# EAGLE design Teensy_Stromzaehler (EAGLE 9.6.0)
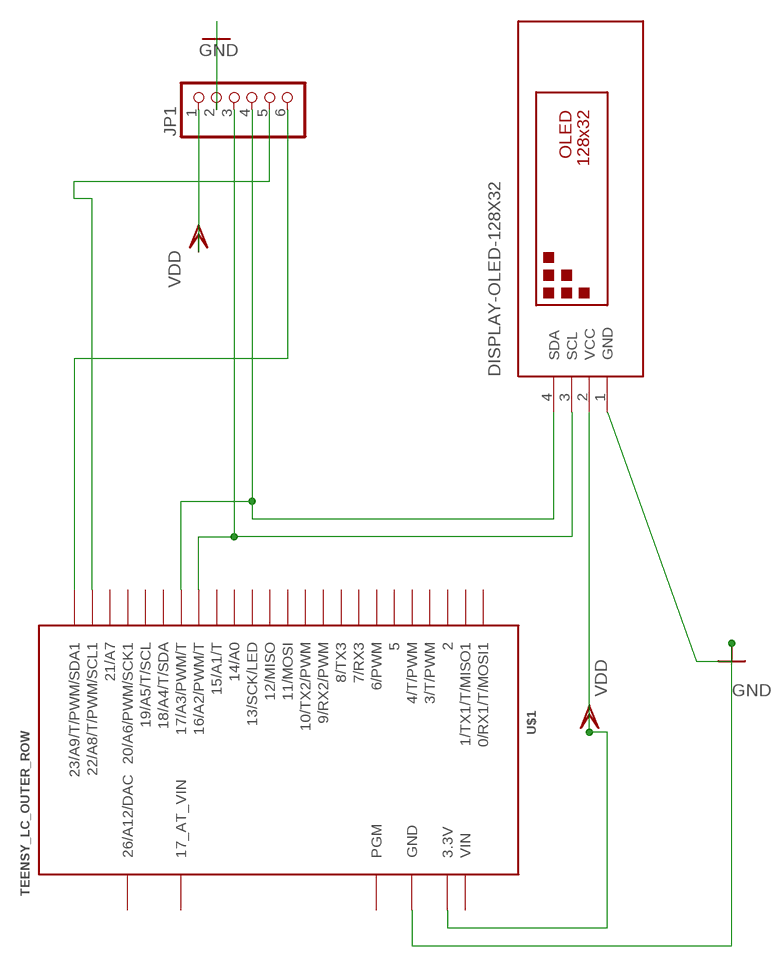
[diagram p0: schematic, sheet 1]

## Parts
JP1  PINHD-1X6  [1X06]
U$1  TEENSY_LC_OUTER_ROW  [TEENSY_3.0-3.2&LC_OUTER_ROW]
U$3  DISPLAY-OLED-128X32  [DISPLAY-OLED-128X32]

## Nets
GND: JP1.2 U$1.AGND(GND) U$1.GND U$1.GND1(GND) U$3.1(GND)
N$3: JP1.5 U$1.22/A8(22/A8/T/PWM/SCL1)
N$4: JP1.6 U$1.23/A9(23/A9/T/PWM/SDA1)
N$14: JP1.3 U$1.16/A2(16/A2/PWM/T) U$3.3(SCL)
N$15: JP1.4 U$1.17/A3(17/A3/PWM/T) U$3.4(SDA)
VDD: JP1.1 U$1.3.3V U$1.3.3V1(3.3V) U$3.2(VCC)
Unconnected: U$1.0(0/RX1/T/MOSI1) U$1.1(1/TX1/T/MISO1) U$1.2 U$1.3(3/T/PWM) U$1.4(4/T/PWM) U$1.5 U$1.6(6/PWM) U$1.7(7/RX3) U$1.8(8/TX3) U$1.9(9/RX2/PWM) U$1.10(10/TX2/PWM) U$1.11(11/MOSI) U$1.12(12/MISO) U$1.13(13/SCK/LED) U$1.14/A0 U$1.15/A1(15/A1/T) U$1.18/A4(18/A4/T/SDA) U$1.19/A5(19/A5/T/SCL) U$1.20/A6(20/A6/PWM/SCK1) U$1.21/A7 U$1.PGM U$1.VBAT(17_AT_VIN)

## Power pins joined to a net without a drawn wire
26/A12/DAC: U$1.RESET/DAC(26/A12/DAC)
VIN: U$1.VIN

## Library data of the parts
JP1 = pinhead:PINHD-1X6: PIN HEADER
U$1 = Teensy_3_and_LC_Series_Boards_v1.4:TEENSY_LC_OUTER_ROW: Teensy LC with only outer row of pins.
U$3 = diy-modules:DISPLAY-OLED-128X32: 128x32 Dot Matrix OLED Module with I2C interface based on SSD1306 chip More details available here: http://www.tinyosshop.com/index.php?route=product/product&product_id=953 Schematic available here: http://www.tinyosshop.com/datasheet/OLED%2012832.pdf SSD1306 datasheet: https://cdn-shop.adafruit.com/datasheets/SSD1306.pdf Click here to find device on ebay.com <http://www.ebay.com/sch/oled+display+128x32+i2c>

## Board
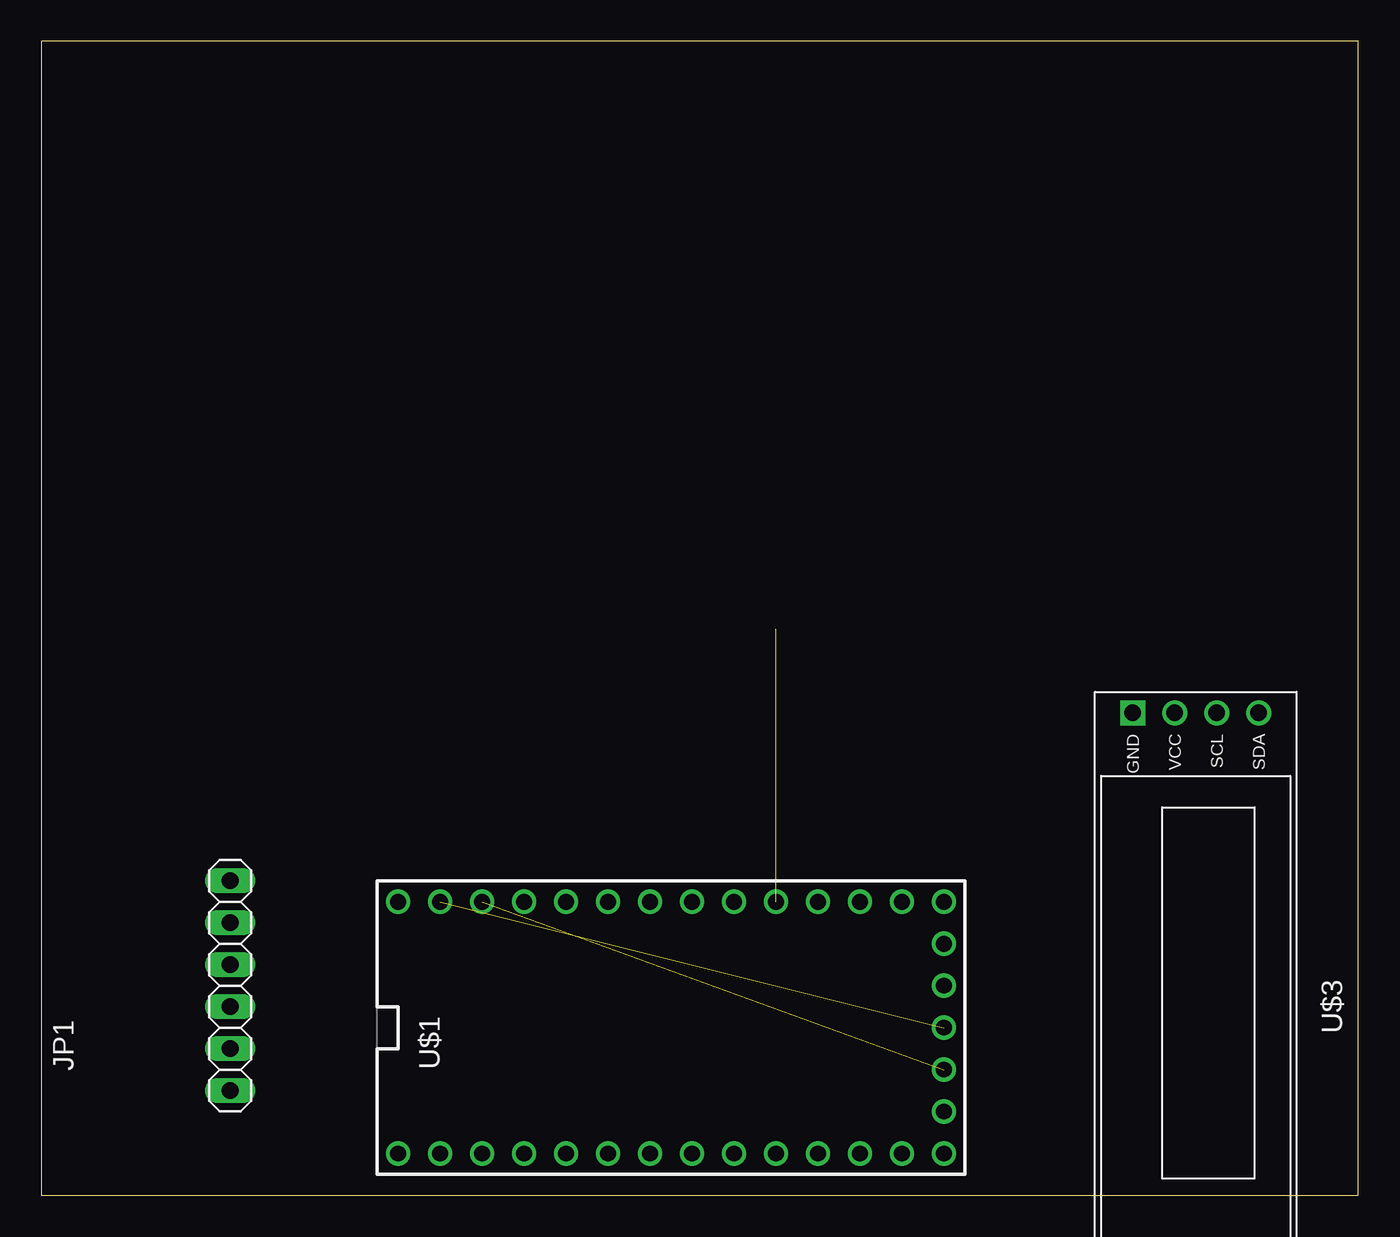
[diagram p1: board, top side]
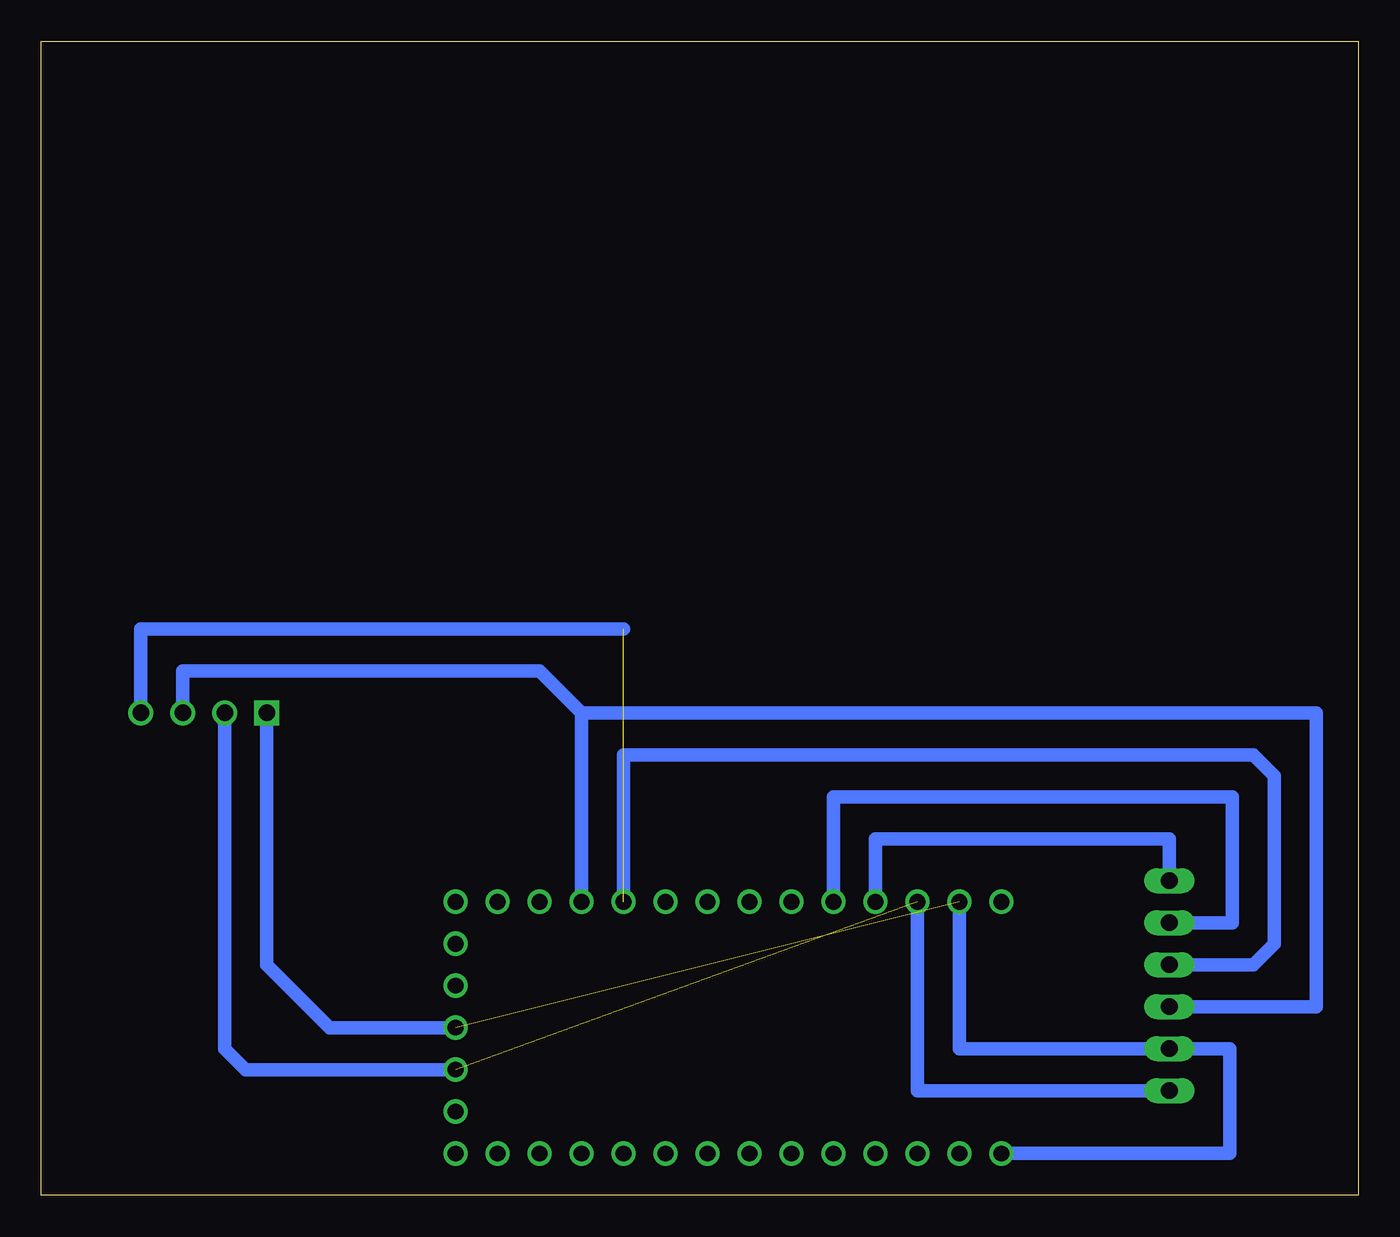
[diagram p2: board, bottom side, seen from below]

Size 79.68 x 69.84 mm. Coordinates in mm from the lower left corner, seen from the top.
Outline: 0,0 79.68,0 79.68,69.84 0,69.84 0,0
Copper layers (1*16): Top 0.035mm / dielectric 1.5mm / Bottom 0.035mm
Design rules "default": minimum track width 6mil, minimum drill 0.35mm, track to track 6mil, track to pad 6mil, pad to pad 6mil, via to via 6mil, smd to smd 6mil, copper to edge 40mil, drill to drill 6mil, minimum pad ring 10mil, minimum via ring 8mil, stop-mask expansion 4mil, vias tented up to drill 0mil, thermal gap 10mil

### Footprints (pad centres in the part's own frame; a part is rotated, then mirrored left to right if it is on the bottom)
1X06 = drill 1.016 long: 1 -6.35,0; 2 -3.81,0; 3 -1.27,0; 4 1.27,0; 5 3.81,0; 6 6.35,0
TEENSY_3.0-3.2&LC_OUTER_ROW = drill 0.965: 0 -7.62,13.97; 1 -7.62,11.43; 2 -7.62,8.89; 3 -7.62,6.35; 3.3V 7.62,11.43; 3.3V1 -2.54,-16.51; 4 -7.62,3.81; 5 -7.62,1.27; 6 -7.62,-1.27; 7 -7.62,-3.81; 8 -7.62,-6.35; 9 -7.62,-8.89; 10 -7.62,-11.43; 11 -7.62,-13.97; 12 -7.62,-16.51; 13 7.62,-16.51; 14/A0 7.62,-13.97; 15/A1 7.62,-11.43; 16/A2 7.62,-8.89; 17/A3 7.62,-6.35; 18/A4 7.62,-3.81; 19/A5 7.62,-1.27; 20/A6 7.62,1.27; 21/A7 7.62,3.81; 22/A8 7.62,6.35; 23/A9 7.62,8.89; AGND 7.62,13.97; GND -7.62,16.51; GND1 0,-16.51; PGM 2.54,-16.51; RESET/DAC 5.08,-16.51; VBAT -5.08,-16.51; VIN 7.62,16.51
DISPLAY-OLED-128X32 = drill 1 square: 1 -17.78,-3.81 | drill 1: 2 -17.78,-1.27; 3 -17.78,1.27; 4 -17.78,3.81

### Placement (x,y rotation side)
JP1  11.43,12.7 90 top
U$1  38.1,10.16 90 top
U$3  69.85,11.43 270 top

### Tracks (layer width: path | path; a pad name or v marks a point on that pad's centre or on a via)
GND  (1 unrouted)
  Bottom 0.813: U$1.GND 7.77,2.54 7.77,8.89 JP1.2 24.13,8.89 U$1.AGND | U$3.1 66.04,13.97 62.23,10.16 U$1.GND1
N$3
  Bottom 0.813: JP1.5 7.62,16.51 7.62,24.13 31.75,24.13 U$1.22/A8
N$4
  Bottom 0.813: JP1.6 11.43,21.59 29.21,21.59 U$1.23/A9
N$14
  Bottom 0.813: JP1.3 2.54,11.43 2.54,29.21 46.99,29.21 | 46.99,29.21 U$1.16/A2 | U$3.3 71.12,31.75 49.53,31.75 46.99,29.21
N$15  (1 unrouted)
  Bottom 0.813: JP1.4 6.35,13.97 5.08,15.24 5.08,25.4 6.35,26.67 44.45,26.67 U$1.17/A3 | U$3.4 73.66,34.29 44.45,34.29
VDD  (1 unrouted)
  Bottom 0.813: JP1.1 26.67,6.35 U$1.3.3V | U$1.3.3V1 67.31,7.62 68.58,8.89 U$3.2